# Altium schematic sheet eBox_relay.SchDoc: eBox_Peripherals
size A4; DocumentNumber: 4; SheetNumber: 4; SheetTotal: 9
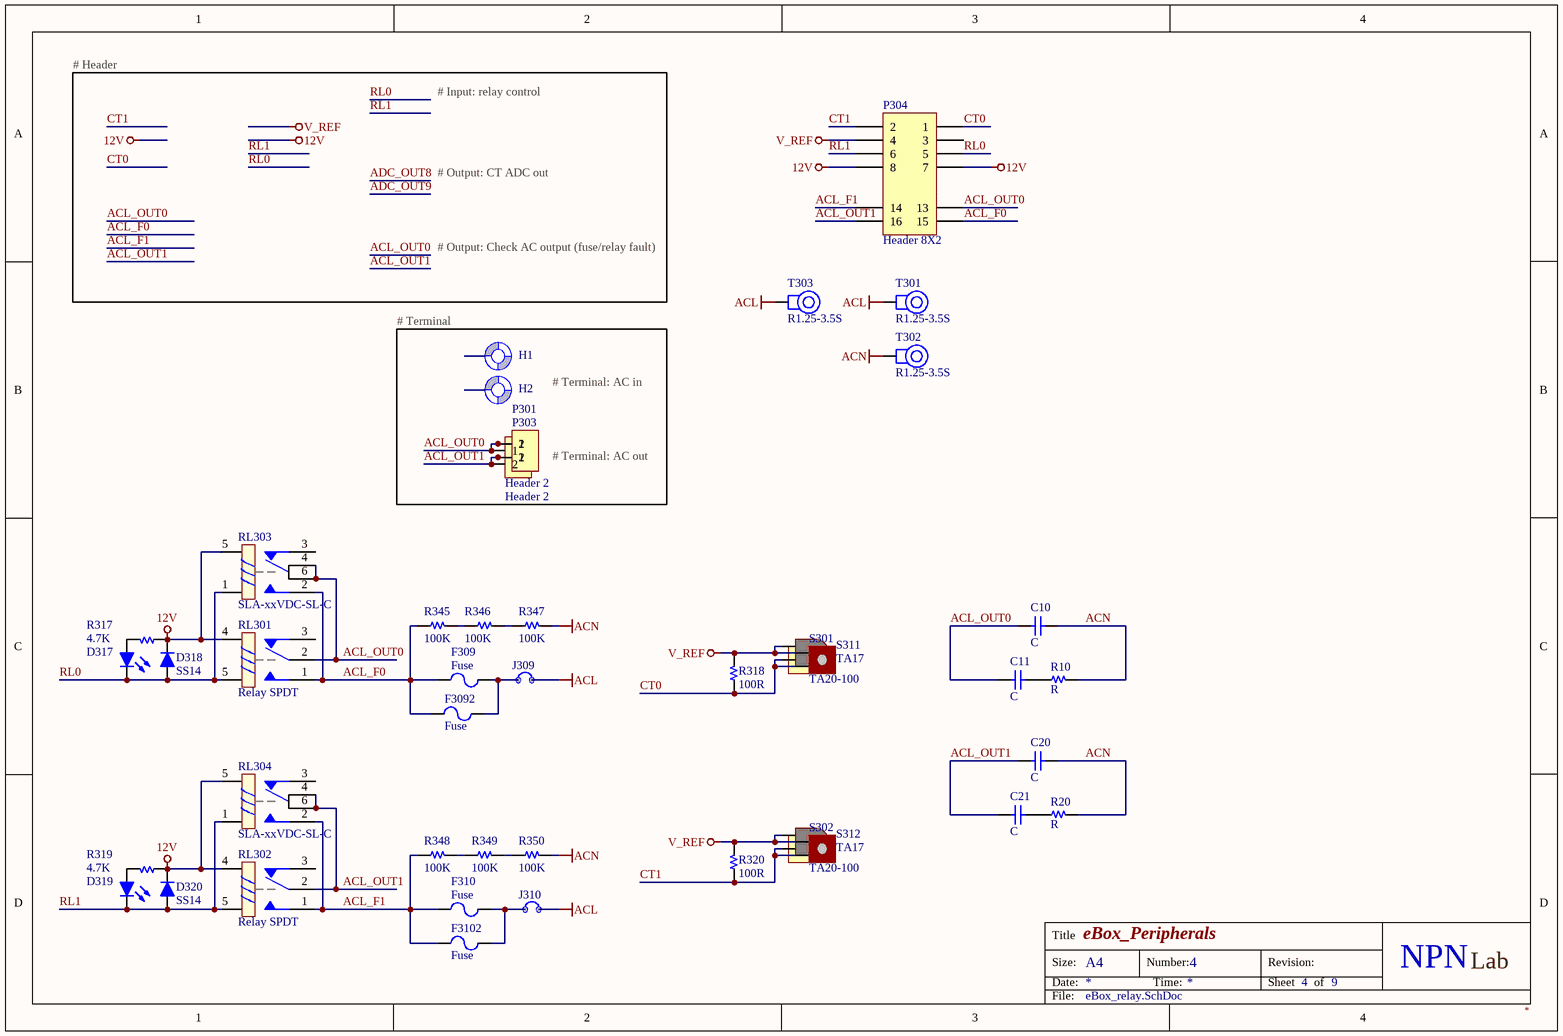
[diagram p0: eBox_relay.SchDoc]

## Parts
C10  C  [CAP Ceramic/W300]
C11  C  [CAP Ceramic/W550]
C20  C  [CAP Ceramic/W300]
C21  C  [CAP Ceramic/W550]
D317  Led  [LED 3MM - green]  (value not drawn)
D318  SS14  [DO-214AC (SMA) L]
D319  Led  [LED 3MM - green]  (value not drawn)
D320  SS14  [DO-214AC (SMA) L]
F309  Fuse  [FUSE 2 DIP 0520 BOX]
F310  Fuse  [FUSE 2 DIP 0520 BOX]
F3092  Fuse  [FUSE 4 DIP 0630]
F3102  Fuse  [FUSE 4 DIP 0630]
H1  Screw Hole  [SCREW/3.2/7.0/M]  (value not drawn)  (no BOM)
H2  Screw Hole  [SCREW/3.2/7.0/M]  (value not drawn)  (no BOM)
J309  JUMP 2 CUSTOM  [JUMP/2/Custom]  (value not drawn)  (no BOM)
J310  JUMP 2 CUSTOM  [JUMP/2/Custom]  (value not drawn)  (no BOM)
P301  Header 2  [HDR/Terminal/2/KF1000]  (no BOM)
P303  Header 2  [HDR/Terminal/2/KF55C-10]
P304  Header 8X2  [HDR/Header/16/DL/EDGE]
P305  Header 2  [HDR/Terminal/2/KF1000]  (value not drawn)  (no BOM)
R10  R  [R 1W]
R20  R  [R 1W]
R317  4.7K  [R 0603]
R318  100R  [R 0805]
R319  4.7K  [R 0603]
R320  100R  [R 0805]
R345  100K  [R 1206]
R346  100K  [R 1206]
R347  100K  [R 1206]
R348  100K  [R 1206]
R349  100K  [R 1206]
R350  100K  [R 1206]
RL301  Relay SPDT  [RL_SPDT_MIX]
RL302  Relay SPDT  [RL_SPDT_MIX]
RL303  SLA-xxVDC-SL-C  [RL_SPDT_30A]
RL304  SLA-xxVDC-SL-C  [RL_SPDT_30A]
S301  TA20-100  [TA20-100]
S302  TA20-100  [TA20-100]
S309  TA12-200  [TA12]  (value not drawn)
S310  NA  [TA12]  (value not drawn)
S311  TA17  [TA17]
S312  TA17  [TA17]
T301  R1.25-3.5S  [R1.25-3.5S]
T302  R1.25-3.5S  [R1.25-3.5S]
T303  R1.25-3.5S  [R1.25-3.5S]

## Nets
12V: D318.2(K) D320.2(K) P304.7 P304.8 R317.1 R319.1 RL301.4(COIL1) RL302.4(COIL1) RL303.5(COIL2) RL304.5(COIL2)
ACL: J309.2 J310.2 T301.1 T303.1
ACN: C10.2 C20.2 R10.2 R20.2 R347.2 R350.2 T302.1
V_REF: P304.4 R318.2 R320.2 S301.3 S302.3 S309.1 S310.1 S311.1 S312.1
ACL_F0: F309.1 F3092.1 P304.15 R345.1 RL301.1(COM) RL303.2(NO)
ACL_F1: F310.1 F3102.1 P304.14 R348.1 RL302.1(COM) RL304.2(NO)
ACL_OUT0: C10.1 C11.1 P301.1 P303.1 P304.13 P305.2 RL301.2(NO) RL303.4(COM) RL303.6(COM)
ACL_OUT1: C20.1 C21.1 P301.2 P303.2 P304.16 P305.1 RL302.2(NO) RL304.4(COM) RL304.6(COM)
CT0: P304.1 R318.1 S301.4 S309.2 S311.2
CT1: P304.2 R320.1 S302.4 S310.2 S312.2
RL0: D317.2(K) D318.1(A) P304.5 RL301.5(COIL2) RL303.1(COIL1)
RL1: D319.2(K) D320.1(A) P304.6 RL302.5(COIL2) RL304.1(COIL1)
NetC11_2: C11.2 R10.1
NetC21_2: C21.2 R20.1
NetD317_1: D317.1(A) R317.2
NetD319_1: D319.1(A) R319.2
NetF309_2: F309.2 F3092.2 J309.1
NetF310_2: F310.2 F3102.2 J310.1
NetR345_2: R345.2 R346.1
NetR346_2: R346.2 R347.1
NetR348_2: R348.2 R349.1
NetR349_2: R349.2 R350.1

Not connected (* = marked no-connect by the designer): H1 1(Screw); H2 1(Screw); P304 3 9 10 11 12; RL301 3(NC); RL302 3(NC); RL303 3(NC); RL304 3(NC)

## Notes on the sheet
- # Header
- # Input: relay control
- # Output: CT ADC out
- # Output: Check AC output (fuse/relay fault)
- (near H1) # Terminal
- # Terminal: AC in
- # Terminal: AC out
- Title
- Size:
- Date:
- A4
- Number:
- Time:
- Revision:
- Sheet
- of
- NPN
- Lab
- File:

## Library data of the parts
C10 C11 C20 C21 = Capacitor NP: Capacitor non-pol
D317 D319 = Led: LED GREEN DIFFUSED 3MM ROUND T/H; TYPE: SMD; PACKAGE: SMD0805; STOCK CODE: HT17-2102SURC; SUPPLIER: tme.vn; STOCK DESC: SMD-0805 High Bright Red Chip LED; UNIT PRICE: 800
D318 D320 = Diode: DIODE SCHOTTKY 40V 1A SMA; BRAND: Toshiba; TYPE: SMD; PACKAGE: DO-214AC; PART NO: SS14; STOCK CODE: SS14; SUPPLIER: tme.vn; STOCK DESC: 1A 40V Schottky Barrier Diode; UNIT PRICE: 1000
P301 P303 P305 = Header 2: Header, 2-Pin
P304 = Header 8X2: Header, 8-Pin, Dual row
R10 R20 = Resistor
R317 R319 = Resistor: RES SMD 4.7K OHM 1% 1/10W 0805; PACKAGE: SMD0805; STOCK CODE: RM10JTN472; SUPPLIER: tme.vn; TYPE: SMD; STOCK DESC: 4.7K 5% SMD-0805 Resistor; UNIT PRICE: 60
R318 R320 = Resistor: RES SMD 100 OHM 1% 1/10W 0805; PACKAGE: SMD0805; STOCK CODE: RM10JTN681; SUPPLIER: tme.vn; TYPE: SMD; STOCK DESC: 680R 5% SMD-0805 Resistor; UNIT PRICE: 60
R345-R350 = Resistor: RES SMD 10K OHM 5% 1/4W 1206; PACKAGE: SMD1206; SUPPLIER: banlinhkien.com; TYPE: SMD; STOCK DESC: RES SMD 10K OHM 5% 1/4W 1206; UNIT PRICE: 240
RL303 RL304 = Relay SPDT_SLA
S309 = TA12: CURR SENSE 1:2000 5A T/H; BRAND: YHDC; PART NO: TA12-200; SUPPLIER: CHINA; TYPE: TH; UNIT PRICE: 22328
S310 = TA12: CURR SENSE 1:2000 5A T/H; PART NO: TA12-200; BRAND: YHDC; SUPPLIER: CHINA; TYPE: TH; UNIT PRICE: 22328
F309 F310 F3092 F3102 = Fuse
  F309 F310: UNIT PRICE: 0
H1 H2 = Screw Hole: TYPE: NO-BOM; UNIT PRICE: 0
J309 J310 = JUMP 2 CUSTOM: TYPE: NO-BOM; UNIT PRICE: 0